# Altium project PCB_TestProject.PrjPcb
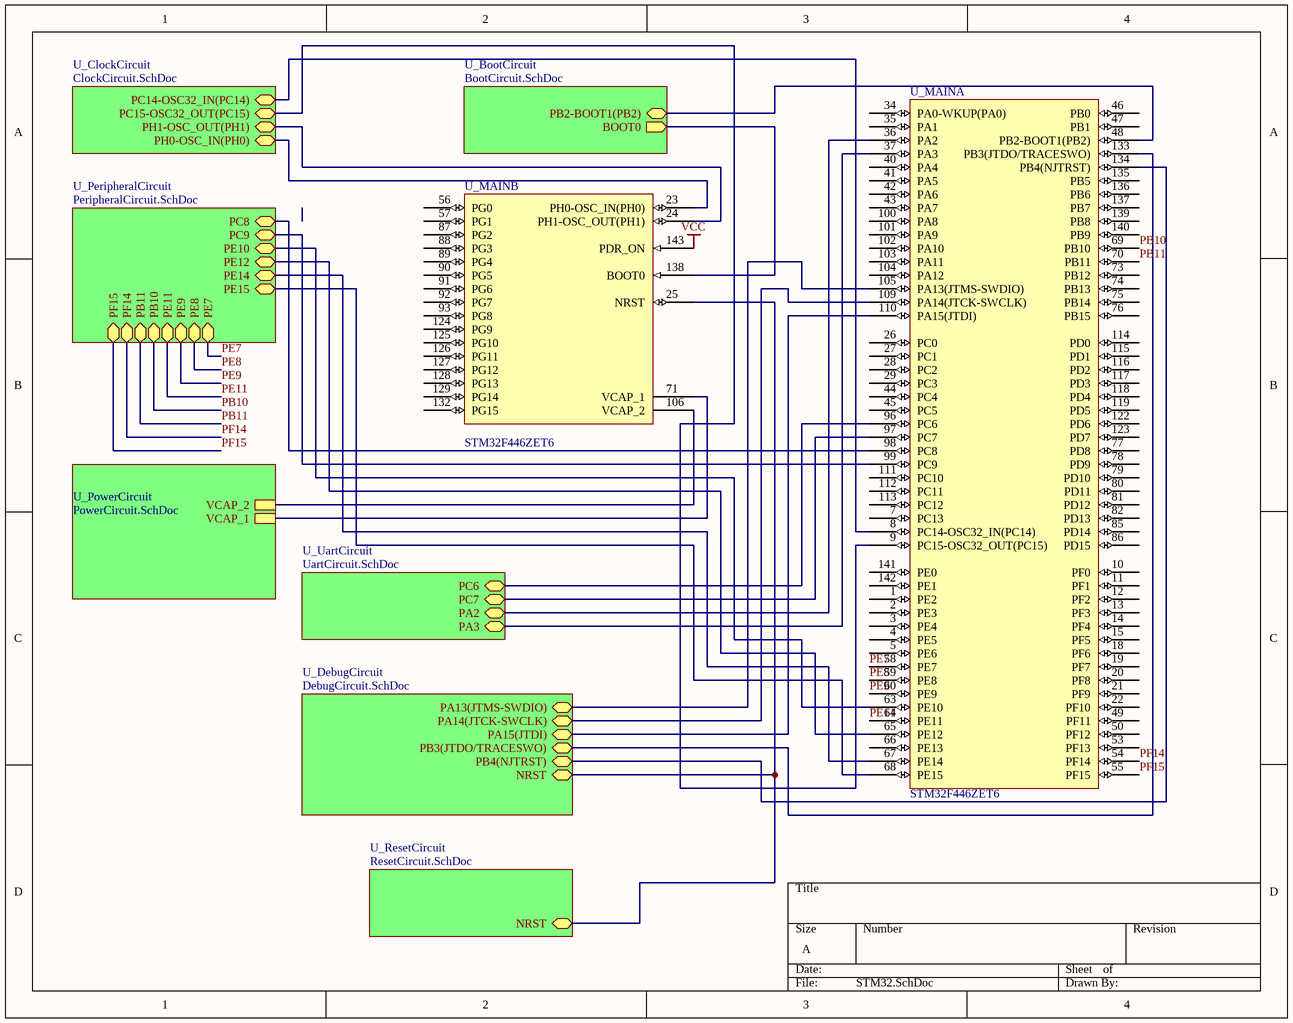
[diagram p0: STM32.SchDoc]
8 sheets, 54 parts. Net scope: hierarchical (ports join the sheet entries above them; power ports are global).
Board file: PCB1.PcbDoc
Sheets:
  STM32.SchDoc
    U_ClockCircuit = ClockCircuit.SchDoc
    U_PowerCircuit = PowerCircuit.SchDoc
    U_UartCircuit = UartCircuit.SchDoc
    U_ResetCircuit = ResetCircuit.SchDoc
    U_BootCircuit = BootCircuit.SchDoc
    U_DebugCircuit = DebugCircuit.SchDoc
    U_PeripheralCircuit = PeripheralCircuit.SchDoc

## Sheet STM32.SchDoc
size A; SheetNumber: 1; SheetTotal: 8

### Parts
U_MAIN  STM32F446ZET6  [STM-LQFP144_M]  (parts A,B of 3)

### Sub-sheets
U_BootCircuit = BootCircuit.SchDoc: BOOT0 (out), PB2-BOOT1(PB2) (bidir)
U_ClockCircuit = ClockCircuit.SchDoc: PC14-OSC32_IN(PC14) (bidir), PC15-OSC32_OUT(PC15) (bidir), PH1-OSC_OUT(PH1) (bidir), PH0-OSC_IN(PH0) (bidir)
U_DebugCircuit = DebugCircuit.SchDoc: PA13(JTMS-SWDIO) (bidir), PA14(JTCK-SWCLK) (bidir), PA15(JTDI) (bidir), PB3(JTDO/TRACESWO) (bidir), PB4(NJTRST) (bidir), NRST (bidir)
U_PeripheralCircuit = PeripheralCircuit.SchDoc: PC8 (bidir), PC9 (bidir), PE10 (bidir), PE12 (bidir), PE14 (bidir), PE15 (bidir), PE7 (bidir), PE8 (bidir), PE9 (bidir), PE11 (bidir), PB10 (bidir), PB11 (bidir), PF14 (bidir), PF15 (bidir)
U_PowerCircuit = PowerCircuit.SchDoc: VCAP_1, VCAP_2
U_ResetCircuit = ResetCircuit.SchDoc: NRST (bidir)
U_UartCircuit = UartCircuit.SchDoc: PC6 (bidir), PC7 (bidir), PA2 (bidir), PA3 (bidir)

### Nets
VCC: U_MAIN.143(PDR_ON)
PB10: U_MAIN.69(PB10) ; sheet U_PeripheralCircuit/PB10
PB11: U_MAIN.70(PB11) ; sheet U_PeripheralCircuit/PB11
PE7: U_MAIN.58(PE7) ; sheet U_PeripheralCircuit/PE7
PE8: U_MAIN.59(PE8) ; sheet U_PeripheralCircuit/PE8
PE9: U_MAIN.60(PE9) ; sheet U_PeripheralCircuit/PE9
PE11: U_MAIN.64(PE11) ; sheet U_PeripheralCircuit/PE11
PF14: U_MAIN.54(PF14) ; sheet U_PeripheralCircuit/PF14
PF15: U_MAIN.55(PF15) ; sheet U_PeripheralCircuit/PF15
NetS1_LEFT_07: U_MAIN.97(PC7) ; sheet U_UartCircuit/PC7
NetS1_LEFT_08: U_MAIN.96(PC6) ; sheet U_UartCircuit/PC6
NetC2_22_1: U_MAIN.71(VCAP_1) ; sheet U_PowerCircuit/VCAP_1
NetC3_22_1: U_MAIN.106(VCAP_2) ; sheet U_PowerCircuit/VCAP_2
NetC_RST_2: U_MAIN.25(NRST) ; sheet U_ResetCircuit/NRST, sheet U_DebugCircuit/NRST
NetENC_LEFT_1: U_MAIN.63(PE10) ; sheet U_PeripheralCircuit/PE10
NetENC_LEFT_2: U_MAIN.65(PE12) ; sheet U_PeripheralCircuit/PE12
NetENC_RIGHT_1: U_MAIN.67(PE14) ; sheet U_PeripheralCircuit/PE14
NetENC_RIGHT_2: U_MAIN.68(PE15) ; sheet U_PeripheralCircuit/PE15
NetJ_ESTOP_PHYS_1: U_MAIN.98(PC8) ; sheet U_PeripheralCircuit/PC8
NetJ_ESTOP_WL_1: U_MAIN.99(PC9) ; sheet U_PeripheralCircuit/PC9
NetJ_JTAG_3: U_MAIN.134(PB4(NJTRST)) ; sheet U_DebugCircuit/PB4(NJTRST)
NetJ_JTAG_5: U_MAIN.110(PA15(JTDI)) ; sheet U_DebugCircuit/PA15(JTDI)
NetJ_JTAG_7: U_MAIN.105(PA13(JTMS-SWDIO)) ; sheet U_DebugCircuit/PA13(JTMS-SWDIO)
NetJ_JTAG_9: U_MAIN.109(PA14(JTCK-SWCLK)) ; sheet U_DebugCircuit/PA14(JTCK-SWCLK)
NetJ_JTAG_13: U_MAIN.133(PB3(JTDO/TRACESWO)) ; sheet U_DebugCircuit/PB3(JTDO/TRACESWO)
NetR0_1: U_MAIN.138(BOOT0) ; sheet U_BootCircuit/BOOT0
NetR1_1: U_MAIN.48(PB2-BOOT1(PB2)) ; sheet U_BootCircuit/PB2-BOOT1(PB2)
NetR_CLK1_1: U_MAIN.8(PC14-OSC32_IN(PC14)) ; sheet U_ClockCircuit/PC14-OSC32_IN(PC14)
NetR_CLK2_1: U_MAIN.9(PC15-OSC32_OUT(PC15)) ; sheet U_ClockCircuit/PC15-OSC32_OUT(PC15)
NetR_CLK3_1: U_MAIN.23(PH0-OSC_IN(PH0)) ; sheet U_ClockCircuit/PH0-OSC_IN(PH0)
NetR_CLK4_1: U_MAIN.24(PH1-OSC_OUT(PH1)) ; sheet U_ClockCircuit/PH1-OSC_OUT(PH1)
NetS1_RIGHT_07: U_MAIN.37(PA3) ; sheet U_UartCircuit/PA3
NetS1_RIGHT_08: U_MAIN.36(PA2) ; sheet U_UartCircuit/PA2

Not connected (* = marked no-connect by the designer): U_MAIN 1(PE2) 2(PE3) 3(PE4) 4(PE5) 5(PE6) 7(PC13) 10(PF0) 11(PF1) 12(PF2) 13(PF3) 14(PF4) 15(PF5) 18(PF6) 19(PF7) 20(PF8) 21(PF9) 22(PF10) 26(PC0) 27(PC1) 28(PC2) 29(PC3) 34(PA0-WKUP(PA0)) 35(PA1) 40(PA4) 41(PA5) 42(PA6) 43(PA7) 44(PC4) 45(PC5) 46(PB0) 47(PB1) 49(PF11) 50(PF12) 53(PF13) 56(PG0) 57(PG1) 66(PE13) 73(PB12) 74(PB13) 75(PB14) 76(PB15) 77(PD8) 78(PD9) 79(PD10) 80(PD11) 81(PD12) 82(PD13) 85(PD14) 86(PD15) 87(PG2) 88(PG3) 89(PG4) 90(PG5) 91(PG6) 92(PG7) 93(PG8) 100(PA8) 101(PA9) 102(PA10) 103(PA11) 104(PA12) 111(PC10) 112(PC11) 113(PC12) 114(PD0) 115(PD1) 116(PD2) 117(PD3) 118(PD4) 119(PD5) 122(PD6) 123(PD7) 124(PG9) 125(PG10) 126(PG11) 127(PG12) 128(PG13) 129(PG14) 132(PG15) 135(PB5) 136(PB6) 137(PB7) 139(PB8) 140(PB9) 141(PE0) 142(PE1)

### Library data of the parts
U_MAIN = CMP-0243-00226-1: ARM Cortex-M4 32-bit MCU+FPU, 512 KB Flash, 128 KB Internal RAM, 114 I/Os, 144-Pin LQFP, -40 to 85 degC, Tray; Operating Frequency(F) (Processor speed) (MHz): 180; Internal RAM Size (kB): 128; FLASH Size (Prog) (kB): 512; I/Os (High Current): 114; D/A Converter: 2; Supply Voltage(Vcc) min (V): 1.7; DatasheetVersion: Rev. 6; Package Reference: 144-Pin Low Profile Quad Flat Package, Body 20 x 20 mm, Pitch 0.5 mm; Package Description: LQFP144; ComponentLink2Description: Datasheet; ComponentLink2URL: http://www.st.com/st-web-ui/static/active/en/resource/technical/document/datasheet/DM00141306.pdf; Mounting Technology: Surface Mount; ComponentLink1Description: Manufacturer URL; Core: ARM Cortex-M4; ComponentLink1URL: http://www.st.com/; Packing: Tray

## Sheet ClockCircuit.SchDoc
size A; SheetNumber: 3; SheetTotal: 8
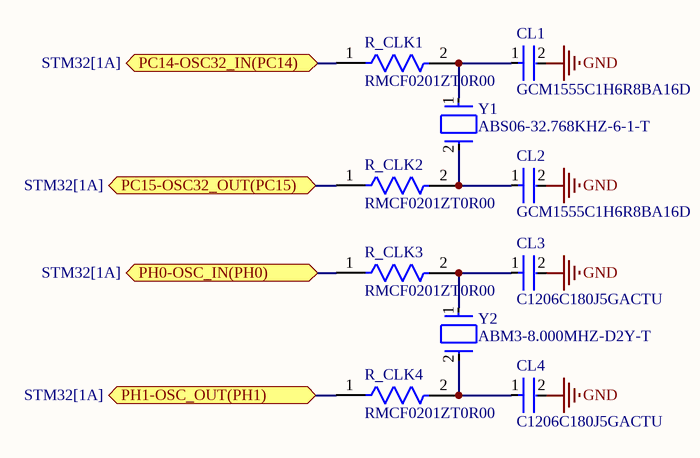
[diagram p1: ClockCircuit.SchDoc]

### Parts
CL1  GCM1555C1H6R8BA16D  [FP-GCM155-0_05-MFG]
CL2  GCM1555C1H6R8BA16D  [FP-GCM155-0_05-MFG]
CL3  C1206C180J5GACTU  [FP-C1206C-EB-MFG]
CL4  C1206C180J5GACTU  [FP-C1206C-EB-MFG]
R_CLK1  RMCF0201ZT0R00  [FP-RMCF0201-IPC_C]
R_CLK2  RMCF0201ZT0R00  [FP-RMCF0201-IPC_C]
R_CLK3  RMCF0201ZT0R00  [FP-RMCF0201-IPC_C]
R_CLK4  RMCF0201ZT0R00  [FP-RMCF0201-IPC_C]
Y1  ABS06-32.768KHZ-6-1-T  [FP-ABS06-MFG]
Y2  ABM3-8.000MHZ-D2Y-T  [FP-ABM3-MFG]

### Ports
PC14-OSC32_IN(PC14) (bidir, see STM32[1A]), PC15-OSC32_OUT(PC15) (bidir, see STM32[1A]), PH0-OSC_IN(PH0) (bidir, see STM32[1A]), PH1-OSC_OUT(PH1) (bidir, see STM32[1A])

### Nets
GND: CL1.2 CL2.2 CL3.2 CL4.2
NetCL1_1: CL1.1 R_CLK1.2 Y1.1
NetCL2_1: CL2.1 R_CLK2.2 Y1.2
NetCL3_1: CL3.1 R_CLK3.2 Y2.1
NetCL4_1: CL4.1 R_CLK4.2 Y2.2
NetR_CLK1_1: R_CLK1.1 ; port PC14-OSC32_IN(PC14)
NetR_CLK2_1: R_CLK2.1 ; port PC15-OSC32_OUT(PC15)
NetR_CLK3_1: R_CLK3.1 ; port PH0-OSC_IN(PH0)
NetR_CLK4_1: R_CLK4.1 ; port PH1-OSC_OUT(PH1)

### Library data of the parts
CL1 CL2 = CMP-06035-015550-1: Ceramic Capacitor for Automotive 6.8pF ±0.1pF 50VDC C0G 0402 Paper T/R; Voltage Rating: 50V; Capacitance: 6.8pF; Case/Package: 0402; Packaging: Cut Tape; Max Operating Temperature: 125°C; Mount: Surface Mount; Ratings: AEC-Q200; Min Operating Temperature: -55°C
CL3 CL4 = CMP-1037-00893-2: 1206 C 18pF Ceramic Multilayer Capacitor; 50 VDC; +125degC; C0G Dielec; +/-5%; Manufacturer: KEMET; Tolerance: 0.05; Temperature Coefficient: 15%; Automotive Grade: Grade 0; Voltage Rating: 50 V; Description: C1206 18 pF C0G 5.00% 50 V; Temperature Range High: +150°C; Lead Free: Yes; Device Class L3: Ceramic Capacitors; Capacitance: 18 pF; ComponentLink2Description: Datasheet; ComponentLink2URL: https://content.kemet.com/datasheets/KEM_C1007_X8R_ULTRA_150C_SMD.pdf; Digikey Description: 1206 C 18pF Ceramic Multilayer Capacitor; 50 VDC; +125degC; C0G Dielec; +/-5%; Device Class L1: Passive Components; Automotive: Yes; Temperature Range Low: -55°C; Ipc Land Pattern Name: CAPC320160X78; Temperature Characteristic: C0G; Value: 18 pF; Height: 0.88mm; Mouser Description: 1206 C 18pF Ceramic Multilayer Capacitor; 50 VDC; +125degC; C0G Dielec; +/-5%; Material: Ceramic; Octopart: https://octopart.com/c1206c180j5gactu-kemet-90945; Device Class L2: Capacitors; RoHS: TRUE; Package: C1206C-EB; Manufacturer Part Number: C1206C180J5GACTU; Temperature: -55°C to +150°C; Category: Cap
R_CLK1-R_CLK4 = CMP-26527-001890-1: 0Ω ±0 0.05W 0201 Thick Film Chip Resistor AEC-Q200 compliant; Max Power Dissipation: 50mW; Resistance: 0R; Packaging: Tape and Reel; Case/Package: 0201; Lead Free: Lead Free; Mount: Surface Mount; Series: RMCF; Power Rating: 50mW; Max Operating Temperature: 125°C; Resistor Type: Thick Film; Height - Seated (Max): 0.01inch; Package Quantity: 10000; RoHS Compliant: Yes; Case Code (Metric): 0603; Height: 0.009inch; Radiation Hardening: No; Case Code (Imperial): 0201; Number of Terminations: 2; Contact Plating: Tin; Width: 0.012inch; Min Operating Temperature: -55°C; Length: 0.024inch
Y1 = CMP-27762-015779-1: Crystal 32.768kHz ±10ppm (Tol) 6pF FUND 90kΩ 2-Pin Mini-CSMD T/R; ESR (Equivalent Series Resistance): 90kR; Series: ABS06; RoHS Compliant: Yes; Frequency: 32.768kHz; Packaging: Tape and Reel; Frequency Tolerance: 10ppm; Min Operating Temperature: -40°C; Max Operating Temperature: 85°C; Load Capacitance: 6pF; Mount: Surface Mount; Case/Package: SMD/SMT
Y2 = CMP-2000-05033-2: Crystal 8MHz ±20ppm 18pF SMD-2 5mm x 3.2mm; Series Resistance: 500R; Frequency Stability: 30ppm; ESR (Equivalent Series Resistance): 140R; Load Capacitance: 18pF; Height: 0.051inch; Tolerance: 20ppm; Depth: 3.2mm; Max Operating Temperature: 85°C; Frequency: 8MHz; Termination: SMD/SMT; Lead Free: Lead Free; Number of Pins: 2; Width: 3.2mm; RoHS Compliant: Yes; Resistor Type: Ceramic; Length: 5mm; Mount: Surface Mount; Case/Package: CSMD; Package Quantity: 1000; Radiation Hardening: No; Min Operating Temperature: -40°C; Packaging: Tape and Reel; Frequency Tolerance: 20ppm

## Sheet PowerCircuit.SchDoc
size A; SheetNumber: 2; SheetTotal: 8
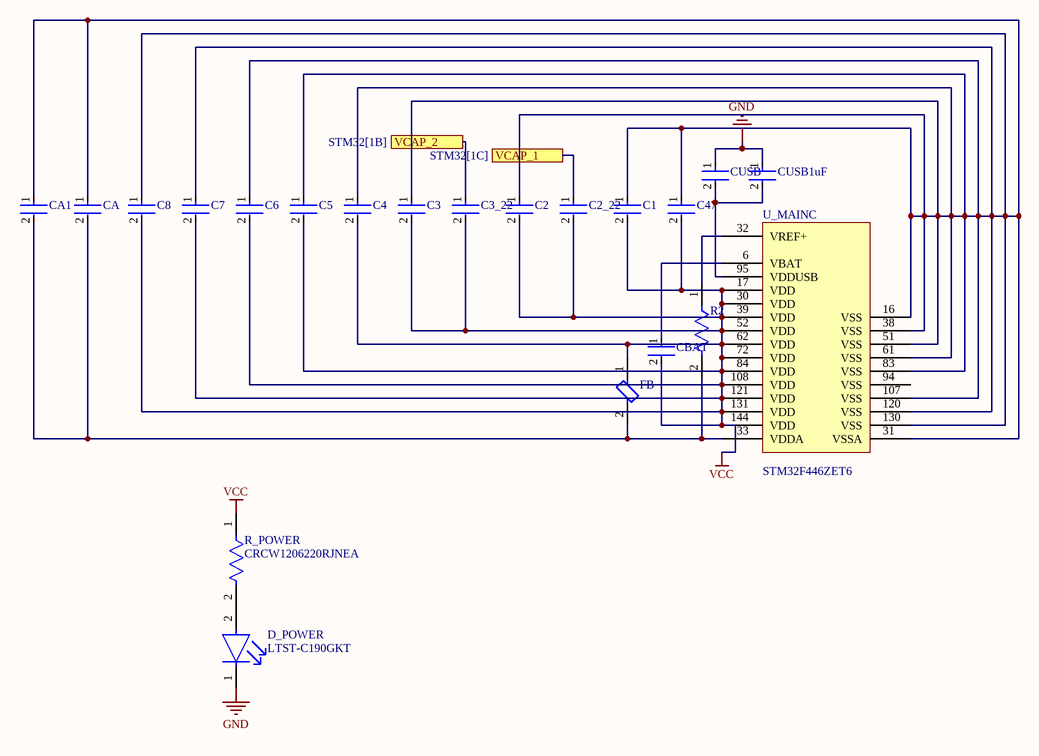
[diagram p2: PowerCircuit.SchDoc]

### Parts
C1  GCM155L81E104KE02D  [FP-GCM155-0_05-IPC_B]  (value not drawn)
C2  GCM155L81E104KE02D  [FP-GCM155-0_05-IPC_B]  (value not drawn)
C2_22  GRM155R61E225ME15D  [FP-GRM155-0_2-0_05-MFG]  (value not drawn)
C3  GCM155L81E104KE02D  [FP-GCM155-0_05-IPC_B]  (value not drawn)
C3_22  GRM155R61E225ME15D  [FP-GRM155-0_2-0_05-MFG]  (value not drawn)
C4  GCM155L81E104KE02D  [FP-GCM155-0_05-IPC_B]  (value not drawn)
C5  GCM155L81E104KE02D  [FP-GCM155-0_05-IPC_B]  (value not drawn)
C6  GCM155L81E104KE02D  [FP-GCM155-0_05-IPC_B]  (value not drawn)
C7  GCM155L81E104KE02D  [FP-GCM155-0_05-IPC_B]  (value not drawn)
C8  GCM155L81E104KE02D  [FP-GCM155-0_05-IPC_B]  (value not drawn)
C47  GRM188R61C475KE11D  [FP-GRM188-0_15-MFG]  (value not drawn)
CA  GCM155L81E104KE02D  [FP-GCM155-0_05-IPC_B]  (value not drawn)
CA1  GRM155R61C105KA12D  [FP-GRM155-0_05-IPC_C]  (value not drawn)
CBAT  GCM155L81E104KE02D  [FP-GCM155-0_05-IPC_B]  (value not drawn)
CUSB  GCM155L81E104KE02D  [FP-GCM155-0_05-IPC_B]  (value not drawn)
CUSB1uF  GCM155L81E104KE02D  [FP-GCM155-0_05-IPC_B]  (value not drawn)
D_POWER  LTST-C190GKT  [FP-LTST-C190GKT-MFG]
FB  BLM15AX601SN1D  [FP-BLM15-0_05-IPC_B]  (value not drawn)
R2  RMCF0201ZT0R00  [FP-RMCF0201-IPC_C]  (value not drawn)
R_POWER  CRCW1206220RJNEA  [FP-CRCW1206-e3-IPC_C]
U_MAIN  STM32F446ZET6  [STM-LQFP144_M]  (part C of 3)

### Ports
VCAP_1 (see STM32[1C]), VCAP_2 (see STM32[1B])

### Nets
GND: CUSB.1 CUSB1uF.1 D_POWER.1(C)
VCC: C1.2 C2.2 C2_22.2 C3.2 C3_22.2 C4.2 C5.2 C6.2 C7.2 C8.2 C47.2 CBAT.2 FB.1 R_POWER.1 U_MAIN.17(VDD) U_MAIN.30(VDD) U_MAIN.39(VDD) U_MAIN.52(VDD) U_MAIN.62(VDD) U_MAIN.72(VDD) U_MAIN.84(VDD) U_MAIN.108(VDD) U_MAIN.121(VDD) U_MAIN.131(VDD) U_MAIN.144(VDD)
NetC1_1: C1.1 C2.1 C3.1 C4.1 C5.1 C6.1 C7.1 C8.1 C47.1 CA.1 CA1.1 U_MAIN.16(VSS) U_MAIN.31(VSSA) U_MAIN.38(VSS) U_MAIN.51(VSS) U_MAIN.61(VSS) U_MAIN.83(VSS) U_MAIN.107(VSS) U_MAIN.120(VSS) U_MAIN.130(VSS)
NetC2_22_1: C2_22.1 ; port VCAP_1
NetC3_22_1: C3_22.1 ; port VCAP_2
NetCA_2: CA.2 CA1.2 FB.2 R2.2 U_MAIN.33(VDDA)
NetCBAT_1: CBAT.1 U_MAIN.6(VBAT)
NetCUSB_2: CUSB.2 CUSB1uF.2 U_MAIN.95(VDDUSB)
NetD_POWER_2: D_POWER.2(A) R_POWER.2
NetR2_1: R2.1 U_MAIN.32(VREF+)

Not connected (* = marked no-connect by the designer): U_MAIN 94(VSS)

### Library data of the parts
C1-C8 CA CBAT CUSB CUSB1uF = CMP-06035-044163-1: Ceramic Capacitor for Automotive 100nF ±10% 25VDC X8L 0402 Paper T/R
C2_22 C3_22 = CMP-06035-061317-1: Chip Multilayer Ceramic Capacitors for General Purpose, 0402, 2.2uF, X5R, 15%, 20%, 25V; Length: 0.039inch; Width: 0.02inch; Case Code (Imperial): 0402; Package Quantity: 10000; Voltage Rating: 25V; Mount: Surface Mount; Height: 0.5mm; Voltage Rating (DC): 25V; Capacitance: 2.2uF; Thickness: 0.022inch; Termination: SMD/SMT; Max Operating Temperature: 85°C; Dielectric: X5R; Tolerance: 20%; Case/Package: 0402; Case Code (Metric): 1005; Weight: 0.000212oz; Packaging: Tape and Reel; Min Operating Temperature: -55°C
C47 = CMP-06035-007733-2: Chip Multilayer Ceramic Capacitors for General Purpose, 0603, 4.7uF, X5R, 15%, 10%, 16V; Min Operating Temperature: -55°C; Case Code (Imperial): 0603; Height: 0.8mm; Series: GRM; Voltage Rating (DC): 16V; Case Code (Metric): 1608; Package Quantity: 4000; Tolerance: 10%; Capacitance: 4.7uF; Mount: Surface Mount; Termination: SMD/SMT; Resistor Type: Ceramic; Lead Free: Lead Free; Voltage Rating: 16V; RoHS Compliant: Yes; Case/Package: 0603; Max Operating Temperature: 85°C; Length: 0.063inch; Weight: 0.000222oz; Packaging: Tape and Reel; Thickness: 0.037inch; Width: 0.031inch; Dielectric: X5R
CA1 = CMP-2008-04573-2: Chip Multilayer Ceramic Capacitors for General Purpose, 0402, 1.0uF, X5R, 15%, 10%, 16V; Capacitance: 1uF; Case Code (Imperial): 0402; Max Operating Temperature: 85°C; Mount: Surface Mount; Voltage Rating (DC): 16V; Material: Ceramic; Depth: 0.5mm; Voltage: 16V; Height: 0.5mm; Dielectric: X5R; Thickness: 0.022inch; Lead Free: Lead Free; Min Operating Temperature: -55°C; Packaging: Tape and Reel; Radiation Hardening: No; Case/Package: 0402; Width: 0.02inch; Length: 1mm; REACH SVHC: No SVHC; Case Code (Metric): 1005; Voltage Rating: 16V; Tolerance: 10%
D_POWER = CMP-22017-000005-2: LED GREEN CLEAR CHIP SMD; Dominant Wavelength: 569nm; Reverse Voltage: 5V; Lens Color: Colorless; Viewing Angle: 130°; Voltage: 2V; Forward Current: 30mA; Power Dissipation: 100mW; Luminous Intensity: 6mcd; Number of LEDs: 1; Forward Voltage: 2.1V; Wavelength: 565nm; Test Current: 10mA; Min Operating Temperature: -55°C; Lens Style: Clear; Mount: Surface Mount; Width: 0.8mm; Packaging: Tape and Reel; Lens Transparency: Clear; Case Code (Metric): 1608; Depth: 0.8mm; Case Code (Imperial): 0603; Case/Package: 0603; Number of Pins: 2; Max Operating Temperature: 85°C; Lead Free: Lead Free; Number of Elements: 1; Length: 1.6mm; Height: 0.8mm; Package Quantity: 1; Power Rating: 100mW; Radiation Hardening: No; Illumination Color: Green; Color: Green
FB = CMP-0686-00246-4: Chip Ferrite Bead, 0402, 600Ω @ 100MHz, 0.34Ω, 25%, 500mA; DC Resistance (DCR): 340mR; Impedance: 600R; Number of Circuits: 1; Max Current Rating: 500mA; Material: Steel; Core Material: Ferrite; Lead Free: Lead Free; Series: BLM15AX_SN; Number of Pins: 2; Package Quantity: 1; Length: 1mm; Height: 0.5mm; Width: 0.5mm; Packaging: Tape and Reel; RoHS Compliant: Yes; Test Frequency: 100MHz; Case Code (Imperial): 0402; Depth: 0.5mm; Case/Package: 0402; Min Operating Temperature: -55°C; Max Operating Temperature: 125°C; Max DC Current: 500mA; Current Rating: 500mA; REACH SVHC: No SVHC; Termination: SMD/SMT; Tolerance: 25%; Case Code (Metric): 1005; Number of Lines: 1; DC Resistance-Max: 340mR
R2 = CMP-26527-001890-1: as R_CLK1 on sheet ClockCircuit; Packaging: Tape and Reel; Case/Package: 0201; Lead Free: Lead Free; Mount: Surface Mount; Series: RMCF; Power Rating: 50mW; Max Operating Temperature: 125°C; Resistor Type: Thick Film; Height - Seated (Max): 0.01inch; Package Quantity: 10000; RoHS Compliant: Yes; Case Code (Metric): 0603; Height: 0.009inch; Radiation Hardening: No; Case Code (Imperial): 0201; Number of Terminations: 2; Contact Plating: Tin; Width: 0.012inch; Min Operating Temperature: -55°C; Length: 0.024inch
R_POWER = CMP-1014-00058-3: RES Thick Film, 220Ω, 5%, 0.25W, 200ppm/°C, 1206; Voltage Rating: 200V; Max Power Dissipation: 250mW; Resistance: 220R; Length: 3.2mm; Weight: 0.000353oz; Termination: SMD/SMT; Min Operating Temperature: -55°C; Height: 0.55mm; Temperature Coefficient: 200ppm/°C; Case Code (Imperial): 1206; Max Operating Temperature: 155°C; Depth: 1.6mm; Width: 0.063inch; Lead Free: Lead Free; Tolerance: 5%; Composition: Thick Film; Case Code (Metric): 3216; Features: Automotive AEC-Q200; Number of Terminations: 2; Voltage Rating (DC): 200V; Packaging: Tape and Reel; Case/Package: 1206; Military Standard: Not; Radiation Hardening: No; Contact Plating: Tin; Package Quantity: 5000; Power Rating: 250mW
U_MAIN = CMP-0243-00226-1: as U_MAIN on sheet STM32; DatasheetVersion: Rev. 6; Package Reference: 144-Pin Low Profile Quad Flat Package, Body 20 x 20 mm, Pitch 0.5 mm; Package Description: LQFP144; ComponentLink2Description: Datasheet; ComponentLink2URL: http://www.st.com/st-web-ui/static/active/en/resource/technical/document/datasheet/DM00141306.pdf; Mounting Technology: Surface Mount; ComponentLink1Description: Manufacturer URL; Core: ARM Cortex-M4; ComponentLink1URL: http://www.st.com/; Packing: Tray

## Sheet UartCircuit.SchDoc
size A; SheetNumber: 4; SheetTotal: 8
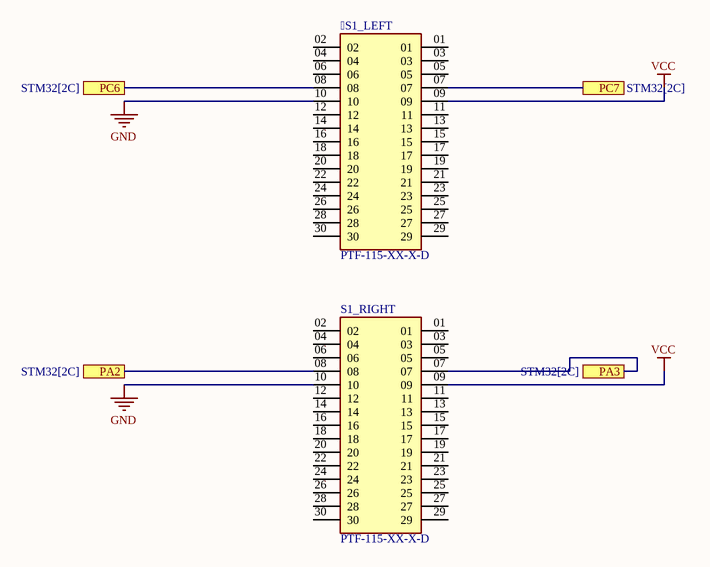
[diagram p3: UartCircuit.SchDoc]

### Parts
S1_LEFT  PTF-115-XX-X-D  [SAMTEC_PTF-115-XX-X-D]
S1_RIGHT  PTF-115-XX-X-D  [SAMTEC_PTF-115-XX-X-D]

### Ports
PA2 (see STM32[2C]), PA3 (see STM32[2C]), PC6 (see STM32[2C]), PC7 (see STM32[2C])

### Nets
GND: S1_LEFT.10 S1_RIGHT.10
VCC: S1_LEFT.09 S1_RIGHT.09
NetS1_LEFT_07: S1_LEFT.07 ; port PC7
NetS1_LEFT_08: S1_LEFT.08 ; port PC6
NetS1_RIGHT_07: S1_RIGHT.07 ; port PA3
NetS1_RIGHT_08: S1_RIGHT.08 ; port PA2

Not connected (* = marked no-connect by the designer): S1_LEFT 01 02 03 04 05 06 11 12 13 14 15 16 17 18 19 20 21 22 23 24 25 26 27 28 29 30; S1_RIGHT 01 02 03 04 05 06 11 12 13 14 15 16 17 18 19 20 21 22 23 24 25 26 27 28 29 30

### Library data of the parts
S1_LEFT S1_RIGHT = PTF-115-XX-X-D: Headers & Wire Housings 2.00 mm Press-Fit Socket Strip; MF: Samtec; Package: None; Price: None; Value: *; MP: PTF-115-XX-X-D; Availability: Unavailable

## Sheet ResetCircuit.SchDoc
size A; SheetNumber: 5; SheetTotal: 8
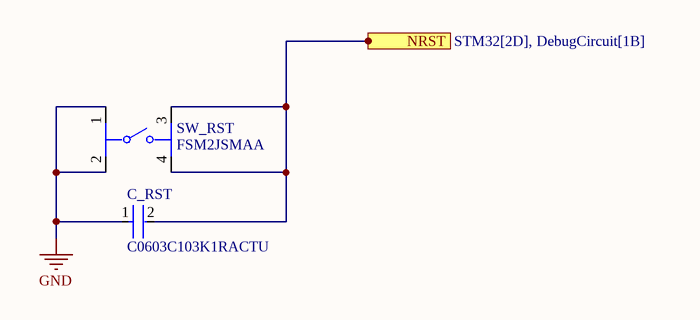
[diagram p4: ResetCircuit.SchDoc]

### Parts
C_RST  C0603C103K1RACTU  [FP-C0603C-CF-MFG]
SW_RST  FSM2JSMAA  [FP-FSM2JSMAA-MFG]

### Ports
NRST (see STM32[2D], DebugCircuit[1B])

### Nets
GND: C_RST.1 SW_RST.1 SW_RST.2
NetC_RST_2: C_RST.2 SW_RST.3 SW_RST.4 ; port NRST

### Library data of the parts
C_RST = CMP-2006-03036-2: CAP CER 10000PF 100V X7R 0603; Manufacturer: KEMET; Temperature Coefficient: 30ppm/°C; Capacitance: 10,000 pF; Automotive Grade: Grade 1; Value: 10,000 pF; Tolerance: 0.1; ComponentLink2URL: https://api.kemet.com/component-edge/download/datasheet/C0603C100J5GACAUTO.pdf; Height: 0.87mm; ComponentLink2Description: Datasheet; Category: Cap; Mouser Description: Multilayer Ceramic Capacitors MLCC - SMD/SMT 100volts 10000pF X7R 10%; Device Class L3: Ceramic Capacitors; Voltage Rating: 100 V; Temperature Range High: +125°C; Octopart: https://octopart.com/c0603c103k1ractu-kemet-134140; Package: C0603C-CF; Temperature Range Low: -55°C; Device Class L1: Passive Components; Temperature: -55°C to +125°C; RoHS: TRUE; Device Class L2: Capacitors; Lead Free: Yes; Temperature Characteristic: X7R; Manufacturer Part Number: C0603C103K1RACTU; Material: Ceramic; Digikey Description: CAP CER 10000PF 100V X7R 0603; Automotive: Yes
SW_RST = CMP-03402-000003-1: SWITCH TACTILE SPST-NO 0.05A 24V; Manufacturer: TE Connectivity; Standoff Height: 0.05mm; Contact Current Rating: 50mA; Electromechanical Life: 100000Cycles; Operating Force: 260gf; Contact Resistance: 100mΩ; Package: 0; Temperature Range High: +85°C; Temperature: -35°C to +85°C; Category: Switch; Manufacturer Part Number: FSM2JSMAA; RoHS: TRUE; Mouser Description: Tactile Switches TACTILE 260G FORCE S; Device Class L1: Electromechanical; Mount: Surface Mount; Height: 4.59mm; ComponentLink2URL: https://www.te.com/commerce/DocumentDelivery/DDEController?Action=showdoc&DocId=Customer+Drawing%7F2-1437565-7%7FV%7Fpdf%7FEnglish%7FENG_CD_2-1437565-7_V.pdf%7F2-1437565-8; Temperature Range Low: -35°C; Voltage Rating Dc: 24V; Lead Free: Yes; Automotive: No; Throw Configuration: SPST-NO; Octopart: https://octopart.com/fsm2jsmaa-te+connectivity-41720620; Device Class L2: Switches; Device Class L3: Pushbutton Switches; ComponentLink2Description: Datasheet; Digikey Description: SWITCH TACTILE SPST-NO 0.05A 24V

## Sheet BootCircuit.SchDoc
size A; SheetNumber: 6; SheetTotal: 6
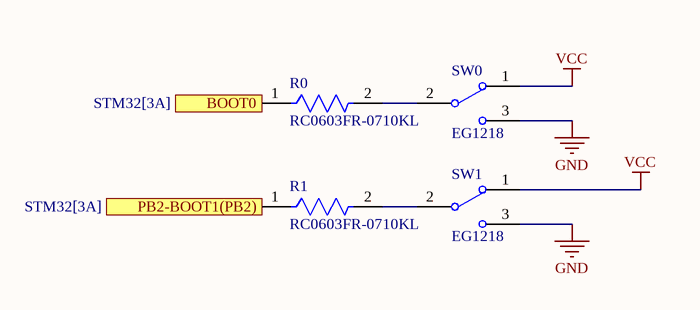
[diagram p5: BootCircuit.SchDoc]

### Parts
R0  RC0603FR-0710KL  [FP-RC0603-0_55-IPC_C]
R1  RC0603FR-0710KL  [FP-RC0603-0_55-IPC_C]
SW0  EG1218  [ESWI-EG1218_V]
SW1  EG1218  [ESWI-EG1218_V]

### Ports
BOOT0 (see STM32[3A]), PB2-BOOT1(PB2) (see STM32[3A])

### Nets
GND: SW0.3 SW1.3
VCC: SW0.1 SW1.1
NetR0_1: R0.1 ; port BOOT0
NetR0_2: R0.2 SW0.2(COM)
NetR1_1: R1.1 ; port PB2-BOOT1(PB2)
NetR1_2: R1.2 SW1.2(COM)

### Library data of the parts
R0 R1 = CMP-2100-03664-2: RES 10K OHM 1% 1/10W 0603; Voltage Rating: 75V; Voltage Rating (DC): 50V; Resistance: 10kR; Power Rating: 100mW; Temperature Coefficient: 100ppm/°C; Depth: 0.8mm; Termination: SMD/SMT; Resistor Type: Thick Film; Series: RC; Construction: Rectangular; Features: Moisture Resistant; Packaging: Tape and Reel; Min Operating Temperature: -55°C; Number of Terminations: 2; Lead Pitch: 0.3mm; RoHS Compliant: Yes; Case/Package: 0603; Resistance Tolerance: 1%; Military Standard: Not; Weight: 7.1E-05oz; Number of Pins: 2; Tolerance: 1%; Length: 1.6mm; Case Code (Imperial): 0603; Lead Free: Lead Free; Width: 0.8mm; Max Power Dissipation: 100mW; Height: 0.45mm; Max Operating Temperature: 155°C; Case Code (Metric): 1608; Size Code: 0603
SW0 SW1 = CMP-1696-00002-1: Slide Switch, 500 V, -20 to 70 degC, 3-Pin THD, RoHS; Case\Package: SOT-23-5; Output Current: 150 mA; Nominal Output Voltage: 3.3 V; Max Power Dissipation: 250 mW; Min Input Voltage: 4.3 V; Outputs: 1; Max Input Voltage: 8 V; Dropout Voltage: 300 mV; PackageDescription: 3-Pin Through Hole Device, Body 11.6 x 4 mm, Pitch 2.5 mm; ComponentLink1URL: http://www.e-switch.ch/en/; RoHSCompliant: true; Length: 3 mm; ComponentLink1Description: Manufacturer URL; Power Rating: 250 mW; Mount: Surface Mount; Max Operating Temperature: 85 degC; REACH SVHC: No SVHC; Radiation Hardening: No; Height: 1.3 mm; Pins: 5; Max Ouput Current: 150 mA; Output Voltage: 3.3 V; Width: 1.8 mm; Package Quantity: 3000; ComponentLink2URL: https://www.e-switch.com/system/asset/product_line/data_sheet/119/EG.pdf; Min Operating Temperature: -40 degC; ComponentLink2Description: Datasheet; DatasheetVersion: Oct-15; PackageReference: EG1218; Packaging: Tape and Reel

## Sheet DebugCircuit.SchDoc
size A; SheetNumber: 7; SheetTotal: 8
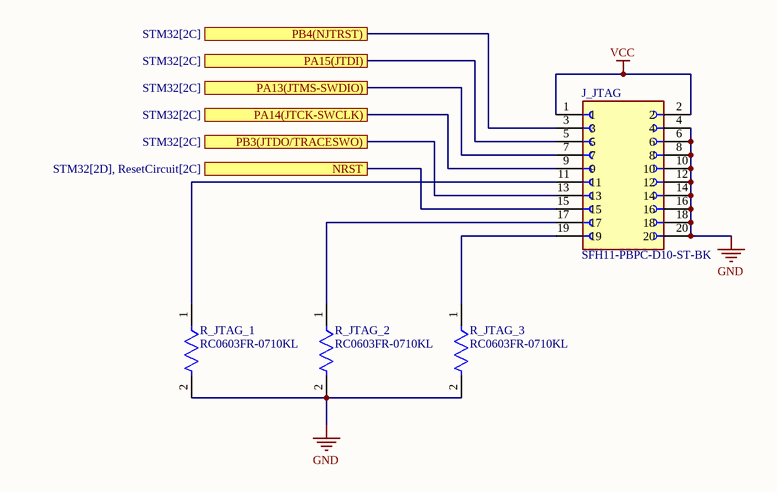
[diagram p6: DebugCircuit.SchDoc]

### Parts
J_JTAG  SFH11-PBPC-D10-ST-BK  [SULLINS_SFH11-PBPC-D10-ST-BK]
R_JTAG_1  RC0603FR-0710KL  [FP-RC0603-0_55-IPC_C]
R_JTAG_2  RC0603FR-0710KL  [FP-RC0603-0_55-IPC_C]
R_JTAG_3  RC0603FR-0710KL  [FP-RC0603-0_55-IPC_C]

### Ports
NRST (see STM32[2D], ResetCircuit[2C]), PA13(JTMS-SWDIO) (see STM32[2C]), PA14(JTCK-SWCLK) (see STM32[2C]), PA15(JTDI) (see STM32[2C]), PB3(JTDO/TRACESWO) (see STM32[2C]), PB4(NJTRST) (see STM32[2C])

### Nets
GND: J_JTAG.4 J_JTAG.6 J_JTAG.8 J_JTAG.10 J_JTAG.12 J_JTAG.14 J_JTAG.16 J_JTAG.18 J_JTAG.20 R_JTAG_1.2 R_JTAG_2.2 R_JTAG_3.2
VCC: J_JTAG.1 J_JTAG.2
NetC_RST_2: J_JTAG.15 ; port NRST
NetJ_JTAG_3: J_JTAG.3 ; port PB4(NJTRST)
NetJ_JTAG_5: J_JTAG.5 ; port PA15(JTDI)
NetJ_JTAG_7: J_JTAG.7 ; port PA13(JTMS-SWDIO)
NetJ_JTAG_9: J_JTAG.9 ; port PA14(JTCK-SWCLK)
NetJ_JTAG_11: J_JTAG.11 R_JTAG_1.1
NetJ_JTAG_13: J_JTAG.13 ; port PB3(JTDO/TRACESWO)
NetJ_JTAG_17: J_JTAG.17 R_JTAG_2.1
NetJ_JTAG_19: J_JTAG.19 R_JTAG_3.1

### Library data of the parts
J_JTAG = SFH11-PBPC-D10-ST-BK: 20 Position Header Connector 0.100 (2.54mm) Through Hole Gold; MF: Sullins Connector; Package: None; Price: None; Check_prices: https://www.snapeda.com/parts/SFH11-PBPC-D10-ST-BK/Sullins+Connector+Solutions/view-part/?ref=eda; Value: *; SnapEDA_Link: https://www.snapeda.com/parts/SFH11-PBPC-D10-ST-BK/Sullins+Connector+Solutions/view-part/?ref=snap; MP: SFH11-PBPC-D10-ST-BK; Availability: In Stock; Purchase-URL: https://pricing.snapeda.com/search?q=SFH11-PBPC-D10-ST-BK&ref=eda
R_JTAG_1-R_JTAG_3 = CMP-2100-03664-2: as R0 on sheet BootCircuit; Depth: 0.8mm; Termination: SMD/SMT; Resistor Type: Thick Film; Series: RC; Construction: Rectangular; Features: Moisture Resistant; Packaging: Tape and Reel; Min Operating Temperature: -55°C; Number of Terminations: 2; Lead Pitch: 0.3mm; RoHS Compliant: Yes; Case/Package: 0603; Resistance Tolerance: 1%; Military Standard: Not; Weight: 7.1E-05oz; Number of Pins: 2; Tolerance: 1%; Length: 1.6mm; Case Code (Imperial): 0603; Lead Free: Lead Free; Width: 0.8mm; Max Power Dissipation: 100mW; Height: 0.45mm; Max Operating Temperature: 155°C; Case Code (Metric): 1608; Size Code: 0603

## Sheet PeripheralCircuit.SchDoc
size A; SheetNumber: 8; SheetTotal: 8
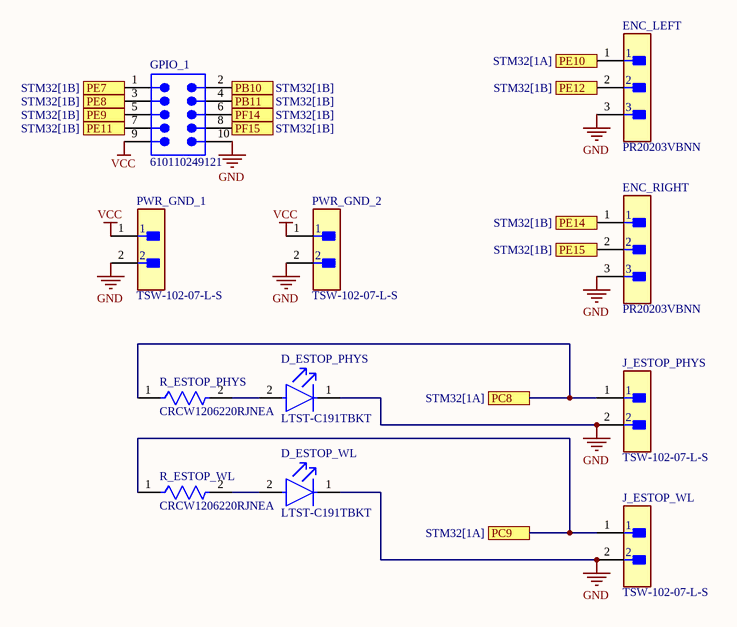
[diagram p7: PeripheralCircuit.SchDoc]

### Parts
D_ESTOP_PHYS  LTST-C191TBKT  [FP-LTST-C191TBKT-MFG]
D_ESTOP_WL  LTST-C191TBKT  [FP-LTST-C191TBKT-MFG]
ENC_LEFT  PR20203VBNN  [FP-PR20203VBNN-MFG]
ENC_RIGHT  PR20203VBNN  [FP-PR20203VBNN-MFG]
GPIO_1  610110249121  [610110249121]
J_ESTOP_PHYS  TSW-102-07-L-S  [FP-TSW-102-07-L-S-MFG]
J_ESTOP_WL  TSW-102-07-L-S  [FP-TSW-102-07-L-S-MFG]
PWR_GND_1  TSW-102-07-L-S  [FP-TSW-102-07-L-S-MFG]
PWR_GND_2  TSW-102-07-L-S  [FP-TSW-102-07-L-S-MFG]
R_ESTOP_PHYS  CRCW1206220RJNEA  [FP-CRCW1206-e3-IPC_C]
R_ESTOP_WL  CRCW1206220RJNEA  [FP-CRCW1206-e3-IPC_C]

### Ports
PB10 (see STM32[1B]), PB11 (see STM32[1B]), PC8 (see STM32[1A]), PC9 (see STM32[1A]), PE7 (see STM32[1B]), PE8 (see STM32[1B]), PE9 (see STM32[1B]), PE10 (see STM32[1A]), PE11 (see STM32[1B]), PE12 (see STM32[1B]), PE14 (see STM32[1B]), PE15 (see STM32[1B]), PF14 (see STM32[1B]), PF15 (see STM32[1B])

### Nets
GND: D_ESTOP_PHYS.1(C) D_ESTOP_WL.1(C) ENC_LEFT.3 ENC_RIGHT.3 GPIO_1.10 J_ESTOP_PHYS.2 J_ESTOP_WL.2 PWR_GND_1.2 PWR_GND_2.2
VCC: GPIO_1.9 PWR_GND_1.1 PWR_GND_2.1
PB10: GPIO_1.2 ; port PB10
PB11: GPIO_1.4 ; port PB11
PE7: GPIO_1.1 ; port PE7
PE8: GPIO_1.3 ; port PE8
PE9: GPIO_1.5 ; port PE9
PE11: GPIO_1.7 ; port PE11
PF14: GPIO_1.6 ; port PF14
PF15: GPIO_1.8 ; port PF15
NetD_ESTOP_PHYS_2: D_ESTOP_PHYS.2(A) R_ESTOP_PHYS.2
NetD_ESTOP_WL_2: D_ESTOP_WL.2(A) R_ESTOP_WL.2
NetENC_LEFT_1: ENC_LEFT.1 ; port PE10
NetENC_LEFT_2: ENC_LEFT.2 ; port PE12
NetENC_RIGHT_1: ENC_RIGHT.1 ; port PE14
NetENC_RIGHT_2: ENC_RIGHT.2 ; port PE15
NetJ_ESTOP_PHYS_1: J_ESTOP_PHYS.1 R_ESTOP_PHYS.1 ; port PC8
NetJ_ESTOP_WL_1: J_ESTOP_WL.1 R_ESTOP_WL.1 ; port PC9

### Library data of the parts
D_ESTOP_PHYS D_ESTOP_WL = CMP-22017-000008-1: LED BLUE CLEAR CHIP SMD; Lens Color: Colorless; Dominant Wavelength: 475nm; Forward Current: 20mA; Wavelength: 468nm; Viewing Angle: 130°; Power Dissipation: 76mW; Luminous Intensity: 180mcd; Reverse Voltage: 5V; Number of Elements: 1; Lens Style: Diffused; Forward Voltage: 3.8V; Max Power Dissipation: 75mW; Case Code (Metric): 1608; Packaging: Tape and Reel; Case/Package: 0603; Depth: 1.6mm; Mount: Surface Mount; Lead Free: Lead Free; Min Operating Temperature: -20°C; Lens Transparency: Clear; Illumination Color: Blue; Height: 0.55mm; Test Current: 20mA; Case Code (Imperial): 0603; Max Operating Temperature: 80°C; Number of Pins: 2; Length: 0.8mm; Radiation Hardening: No; Package Quantity: 1; Number of LEDs: 1; Width: 0.8mm; Color: Blue
ENC_LEFT ENC_RIGHT = CMP-77940-000002-1: CONN HEADER VERT 3POS 2.54MM; Manufacturer: Metz Connect; Conn Orientation: Straight; Current Rating: 3A; Number Of Contacts: 3; Conn Gender: Male; Temperature: -40°C to +105°C; Pitch: 2.54mm; Device Class L1: Connectors; Digikey Description: CONN HEADER VERT 3POS 2.54MM; ComponentLink2URL: https://datasheet.octopart.com/PR20203VBNN-Metz-Connect-datasheet-101610322.pdf; Height: 8.6mm; Temperature Range High: +105°C; Manufacturer Part Number: PR20203VBNN; Number Of Rows: 1; Octopart: https://octopart.com/pr20203vbnn-metz+connect-87667116; Device Class L3: unset; ComponentLink2Description: Datasheet; Device Class L2: Headers and Wire Housings; Temperature Range Low: -40°C; Automotive: No; Contact Material: Gold,Nickel; Category: Conn; Lead Free: Yes; RoHS: TRUE; Package: PR20203VBNN
GPIO_1 = CMP-1502-01148-3: NexarPartId: 52645093; Number of Positions: 10; Connector Type: Male Pin; Row Spacing: 2.54mm; Operating Supply Voltage: 250V; Current Rating: 3A; Contact Resistance: 20mΩ; Gender: Male; Color: Black; Packaging: Tape and Reel; Number of Pins: 10; REACH SVHC: Unknown; Number of Contacts: 10; RoHS: Compliant; Number of Rows: 2; Termination: Solder; Lead Pitch: 2.54mm; Contact Plating: Gold; Contact Mating Length: 5.9944mm; Mount: Surface Mount; Pitch: 2.54mm
J_ESTOP_PHYS J_ESTOP_WL PWR_GND_1 PWR_GND_2 = CMP-02766-001428-1: CONN HEADER VERT 2POS 2.54MM; Voltage Rating: 550V; Current Rating: 7.6A; Gender: Male; Number of Contacts: 2; Connector Type: Male Pin; Radiation Hardening: No; Orientation: Straight; Contact Plating: Gold; Max Operating Temperature: 125°C; Mount: Through Hole; Package Quantity: 1; Number of Rows: 1; Housing Material: Polyester; RoHS Compliant: Yes; Length: 5.08mm; Max Voltage Rating (AC): 550V; Pitch: 2.54mm; Packaging: Bulk; Depth: 2.54mm; Termination: Solder; Min Operating Temperature: -55°C; Housing Color: Black; Lead Free: Lead Free; Color: Black; Number of Positions: 2; Width: 2.54mm; Max Current Rating: 7.6A; REACH SVHC: No SVHC; Contact Material: Bronze; Contact Mating Length: 0.23inch; Series: TSW; Contact Type: Male Pin
R_ESTOP_PHYS R_ESTOP_WL = CMP-1014-00058-3: as R_POWER on sheet PowerCircuit; Length: 3.2mm; Weight: 0.000353oz; Termination: SMD/SMT; Min Operating Temperature: -55°C; Height: 0.55mm; Temperature Coefficient: 200ppm/°C; Case Code (Imperial): 1206; Max Operating Temperature: 155°C; Depth: 1.6mm; Width: 0.063inch; Lead Free: Lead Free; Tolerance: 5%; Composition: Thick Film; Case Code (Metric): 3216; Features: Automotive AEC-Q200; Number of Terminations: 2; Voltage Rating (DC): 200V; Packaging: Tape and Reel; Case/Package: 1206; Military Standard: Not; Radiation Hardening: No; Contact Plating: Tin; Package Quantity: 5000; Power Rating: 250mW

## Nets that join several sheets
GND: ClockCircuit (CL1.2 CL2.2 CL3.2 CL4.2), PowerCircuit (CUSB.1 CUSB1uF.1 D_POWER.1), UartCircuit (S1_LEFT.10 S1_RIGHT.10), ResetCircuit (C_RST.1 SW_RST.1 SW_RST.2), BootCircuit (SW0.3 SW1.3), DebugCircuit (12 pins), PeripheralCircuit (9 pins)
VCC: STM32 (U_MAIN.143), PowerCircuit (25 pins), UartCircuit (S1_LEFT.09 S1_RIGHT.09), BootCircuit (SW0.1 SW1.1), DebugCircuit (J_JTAG.1 J_JTAG.2), PeripheralCircuit (GPIO_1.9 PWR_GND_1.1 PWR_GND_2.1)
NetS1_LEFT_07: STM32 (U_MAIN.97), UartCircuit (S1_LEFT.07)
NetS1_LEFT_08: STM32 (U_MAIN.96), UartCircuit (S1_LEFT.08)
NetC2_22_1: STM32 (U_MAIN.71), PowerCircuit (C2_22.1)
NetC3_22_1: STM32 (U_MAIN.106), PowerCircuit (C3_22.1)
NetC_RST_2: STM32 (U_MAIN.25), ResetCircuit (C_RST.2 SW_RST.3 SW_RST.4), DebugCircuit (J_JTAG.15)
NetENC_LEFT_1: STM32 (U_MAIN.63), PeripheralCircuit (ENC_LEFT.1)
NetENC_LEFT_2: STM32 (U_MAIN.65), PeripheralCircuit (ENC_LEFT.2)
NetENC_RIGHT_1: STM32 (U_MAIN.67), PeripheralCircuit (ENC_RIGHT.1)
NetENC_RIGHT_2: STM32 (U_MAIN.68), PeripheralCircuit (ENC_RIGHT.2)
NetJ_ESTOP_PHYS_1: STM32 (U_MAIN.98), PeripheralCircuit (J_ESTOP_PHYS.1 R_ESTOP_PHYS.1)
NetJ_ESTOP_WL_1: STM32 (U_MAIN.99), PeripheralCircuit (J_ESTOP_WL.1 R_ESTOP_WL.1)
NetJ_JTAG_3: STM32 (U_MAIN.134), DebugCircuit (J_JTAG.3)
NetJ_JTAG_5: STM32 (U_MAIN.110), DebugCircuit (J_JTAG.5)
NetJ_JTAG_7: STM32 (U_MAIN.105), DebugCircuit (J_JTAG.7)
NetJ_JTAG_9: STM32 (U_MAIN.109), DebugCircuit (J_JTAG.9)
NetJ_JTAG_13: STM32 (U_MAIN.133), DebugCircuit (J_JTAG.13)
NetR0_1: STM32 (U_MAIN.138), BootCircuit (R0.1)
NetR1_1: STM32 (U_MAIN.48), BootCircuit (R1.1)
NetR_CLK1_1: STM32 (U_MAIN.8), ClockCircuit (R_CLK1.1)
NetR_CLK2_1: STM32 (U_MAIN.9), ClockCircuit (R_CLK2.1)
NetR_CLK3_1: STM32 (U_MAIN.23), ClockCircuit (R_CLK3.1)
NetR_CLK4_1: STM32 (U_MAIN.24), ClockCircuit (R_CLK4.1)
NetS1_RIGHT_07: STM32 (U_MAIN.37), UartCircuit (S1_RIGHT.07)
NetS1_RIGHT_08: STM32 (U_MAIN.36), UartCircuit (S1_RIGHT.08)
PB10: STM32 (U_MAIN.69), PeripheralCircuit (GPIO_1.2)
PB11: STM32 (U_MAIN.70), PeripheralCircuit (GPIO_1.4)
PE7: STM32 (U_MAIN.58), PeripheralCircuit (GPIO_1.1)
PE8: STM32 (U_MAIN.59), PeripheralCircuit (GPIO_1.3)
PE9: STM32 (U_MAIN.60), PeripheralCircuit (GPIO_1.5)
PE11: STM32 (U_MAIN.64), PeripheralCircuit (GPIO_1.7)
PF14: STM32 (U_MAIN.54), PeripheralCircuit (GPIO_1.6)
PF15: STM32 (U_MAIN.55), PeripheralCircuit (GPIO_1.8)